# Altium schematic sheet CD40106_施密特触发电路.SchDoc
size A4
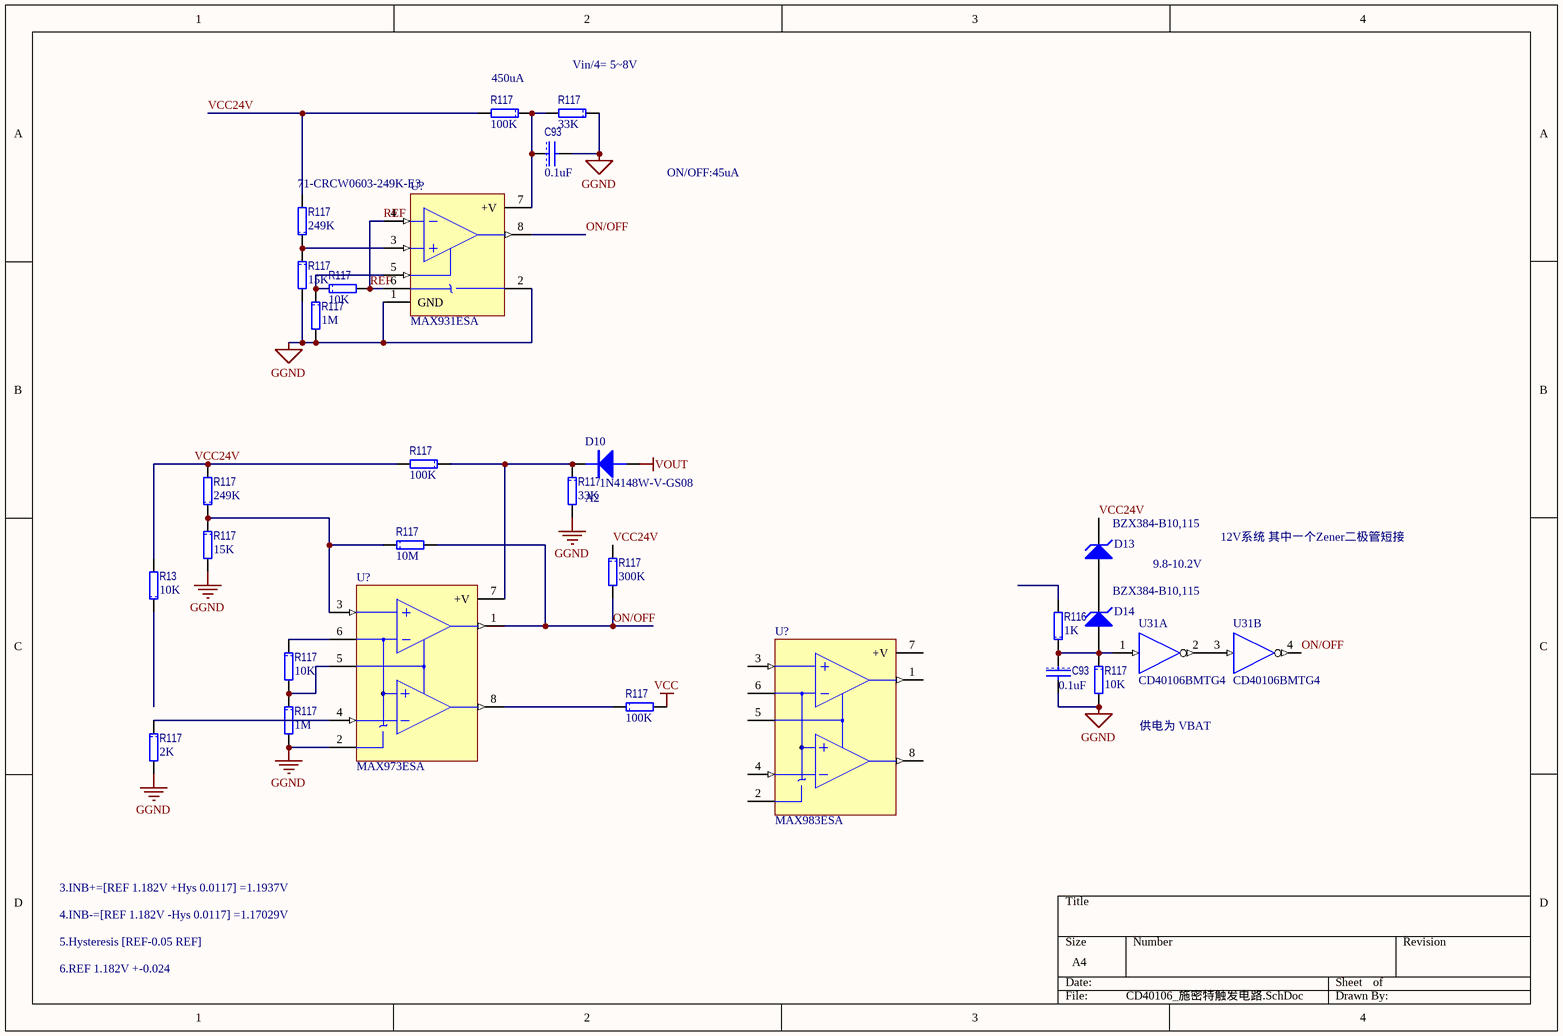
[diagram p0: CD40106_施密特触发电路.SchDoc]

## Parts
(Parts that share a designator on the sheet are numbered #1, #2 ... from top to bottom, then left to right.)
C93#1  value 0.1uF  [1608[0603]C]  (hidden comment: C1608X7R1H104K)
C93#2  value 0.1uF  [1608[0603]C]  (hidden comment: C1608X7R1H104K)
D10  1N4148W-V-GS08  value A2  [SOD323]
D13  BZX384-B10,115  [SOD323]
D14  BZX384-B10,115  [SOD323]
R13  value 10K  [1608[0603]R]  (hidden comment: CRCW0603100KFKEA)
R116  value 1K  [1608[0603]R]  (hidden comment: CRCW06031K00FKEA)
R117#1  value 100K  [1608[0603]R]  (hidden comment: CRCW0603100KFKEA)
R117#2  value 33K  [1608[0603]R]  (hidden comment: CRCW060333K0FKEA)
R117#3  value 249K  Supplier Part Number 1: 71-CRCW0603-249K-E3  [1608[0603]R]  (hidden comment: CRCW0603249KFKEA)
R117#4  value 15K  [1608[0603]R]  (hidden comment: CRCW060315K0FKEA)
R117#5  value 10K  [1608[0603]R]  (hidden comment: CRCW060310K0FKEA)
R117#6  value 1M  [1608[0603]R]  (hidden comment: CRCW060310K0FKEA)
R117#7  value 100K  [1608[0603]R]  (hidden comment: CRCW0603300K0FKEA)
R117#8  value 33K  [1608[0603]R]  (hidden comment: CRCW0603100K0FKEA)
R117#9  value 249K  [1608[0603]R]  (hidden comment: CRCW0603249KFKEA)
R117#10  value 15K  [1608[0603]R]  (hidden comment: CRCW060315K0FKEA)
R117#11  value 10M  [1608[0603]R]  (hidden comment: CRCW060310M0FKEA)
R117#12  value 300K  [1608[0603]R]  (hidden comment: CRCW0603300K0FKEA)
R117#13  value 10K  [1608[0603]R]  (hidden comment: CRCW060310K0FKEA)
R117#14  value 10K  [1608[0603]R]  (hidden comment: CRCW060310K0FKEA)
R117#15  value 100K  [1608[0603]R]  (hidden comment: CRCW0603300K0FKEA)
R117#16  value 1M  [1608[0603]R]  (hidden comment: CRCW060310K0FKEA)
R117#17  value 2K  [1608[0603]R]  (hidden comment: CRCW060310K0FKEA)
U31  CD40106BMTG4  [SOIC14_N]  (parts A,B of 6)
U?#1  MAX931ESA  [NSO8_N]
U?#2  MAX973ESA  [NSO8_N]
U?#3  MAX983ESA  [NSO8_N]

## Nets
GGND: C93#1.2 C93#2.2 R117#2.1 R117#4.2 R117#6.2 R117#8.2 R117#10.2 R117#14.2 R117#16.2 R117#17.2 U?#1.1(GND) U?#1.2(-V) U?#2.2(V-)
GND: U31.7(GGND)
VCC: R117#15.2 U31.14(VBAT)
VOUT: D10.1(A)
ON/OFF: R117#11.2 R117#12.2 U31.4(H) U?#1.8(OUT) U?#2.1(OUTA)
REF: R117#5.2 U?#1.4(IN-) U?#1.6(REF)
VCC24V: D13.2(K) R13.2 R117#1.2 R117#3.2 R117#7.2 R117#9.2 R117#12.1
NetC93#1_1: C93#1.1 R117#1.1 R117#2.2 U?#1.7(+V)
NetC93#2_1: C93#2.1 D14.1(A) R116.1 R117#14.1 U31.1(A)
NetD10_2: D10.2(K) R117#7.1 R117#8.1 U?#2.7(+V)
NetD13_1: D13.1(A) D14.2(K)
NetR117#3_1: R117#3.1 R117#4.1 U?#1.3(IN+)
NetR117#5_1: R117#5.1 R117#6.1 U?#1.5(HYST)
NetR117#9_1: R117#9.1 R117#10.1 R117#11.1 U?#2.3(INA+)
NetR117#13_1: R117#13.1 U?#2.6(REF)
NetR117#13_2: R117#13.2 R117#16.1 U?#2.5(HYST)
NetR117#15_1: R117#15.1 U?#2.8(OUTB)
NetR117#17_1: R117#17.1 U?#2.4(INB-)
NetU31_2: U31.2(G) U31.3(B)

Not connected (* = marked no-connect by the designer): R13 1; R116 2; U?#3 1(OUTA) 2(V-) 3(INA+) 4(INB-) 5(HYST) 6(REF) 7(+V) 8(OUTB)

## Notes on the sheet
- (near R117#1) 450uA
- (near R117#2) Vin/4= 5~8V
- ON/OFF:45uA
- 9.8-10.2V
- 12V系统 其中一个Zener二极管短接
- 供电为 VBAT
- 4.INB-=[REF 1.182V -Hys 0.0117] =1.17029V
- 3.INB+=[REF 1.182V +Hys 0.0117] =1.1937V
- 6.REF 1.182V +-0.024
- 5.Hysteresis [REF-0.05 REF]

## Library data of the parts
C93#1 C93#2 = CAP: 多层陶瓷电容器MLCC - SMD/SMT 0603 0.1uF 50volts X7R 10%; Manufacturer: TDK; 尺寸: 0.8 mm W x 1.6 mm L x 0.8 mm H; 工作温度范围: - 55 C to + 125 C; 封装 / 箱体: 0603 (1608 metric); 封装: Reel; 产品: General Type MLCCs; 系列: C; 电压额定值: 50 V; 电容-nF: 100 nF; 电容-pF: 100000 pF; 外壳代码 - in: 0603; 外壳代码 - mm: 1608; 产品种类: Low & Medium Capacitance SMD Ceramic Chip Capacitors; 标准包装数量: 4000; Supplier 1: Mouser; Supplier Part Number 1: 810-C1608X7R1H104K; Manufacturer Part Number: C1608X7R1H104K; RoHS: RoHS Compliant; Description 1: 多层陶瓷电容器MLCC - SMD/SMT 0603 0.1uF 50volts X7R 10%; Category: 多层陶瓷电容器MLCC - SMD/SMT; Stock 1: 224604; Pricing 1: 1=0.160, 50=0.070, 100=0.036, 500=0.019, 1000=0.013, 4000=0.010, 8000=0.009, 12000=0.008, 20000=0.007 (USD); 电容: 0.1 uF; 端接类型: SMD/SMT; 容差: 10 %; 制造商: TDK; 温度系数/代码: X7R; RoHS - 贸泽: Y; Minimum Order Quantity: 1; Reeling: True; ComponentLink1URL: http://www.tdk.com/pdf/general_B11.pdf; ComponentLink1Description: http://www.tdk.com/pdf/general_B11.pdf
D10 = 1N4148W: 二极管 - 通用，功率，开关 100V Io/150mA; Manufacturer: Vishay Semiconductors; 配置: Single; 工作温度范围: - 65 C to + 150 C; 封装 / 箱体: SOD-123; 封装: Reel; 产品: Switching Diodes; 正向连续电流: 0.15 A; 最大浪涌电流: 0.5 A; 安装风格: SMD/SMT; 恢复时间: 4 ns; 正向电压下降: 1.2 V; 制造商: Vishay; 最大二极管电容: 4 pF; 最大工作温度: + 150 C; 最大功率耗散: 350 mW; 最大反向漏泄电流: 5 uA; 最小工作温度: - 65 C; 标准包装数量: 15000; Supplier 1: Mouser; Supplier Part Number 1: 625-1N4148W-V; Manufacturer Part Number: 1N4148W-V-GS08; RoHS: RoHS Compliant; Category: 二极管 - 通用，功率，开关; Stock 1: 404148; Pricing 1: 1=0.090, 10=0.083, 50=0.072, 100=0.068, 500=0.032, 1000=0.026, 3000=0.021, 9000=0.016, 10000=0.016, 18000=0.014 (USD); 峰值反向电压: 100 V; 产品种类: Switching Diodes; RoHS - 贸泽: Y; Minimum Order Quantity: 1; Reeling: True; ComponentLink1URL: http://www.mouser.com/ds/2/427/1n4148w--240387.pdf; ComponentLink1Description: http://www.mouser.com/ds/2/427/1n4148w--240387.pdf; Description 1: 二极管 - 通用，功率，开关 100V Io/150mA
D13 D14 = D Zener: 稳压二极管 DIODE ZENER 2 PCT; Manufacturer: Vishay Semiconductors; Manufacturer Part Number: BZX384B10-E3-08; Configuration: Single; Power Dissipation: 200 mW; Maximum Reverse Leakage Current: 0.2 uA; Maximum Zener Impedance: 8 Ohms; Voltage Tolerance: 2 %; Zener Voltage: 10 V; Product Status: New at Mouser; Supplier 1: Mouser; Supplier Part Number 1: 78-BZX384B10-E3-08; RoHS: RoHS Compliant; Category: Zener Diodes; Stock 1: 14963; Pricing 1: 1=0.135, 10=0.059, 50=0.058, 100=0.057, 500=0.049, 1000=0.045, 3000=0.043, 9000=0.042, 18000=0.041 (AUD); Package / Case: SOD-323; Packaging: Reel; Product: Zener Diode; Mounting Style: SMD/SMT; Maximum Operating Temperature: + 150 C; Minimum Operating Temperature: - 55 C; Product Category: Schottky Diodes; RoHS - Mouser: Y; Minimum Order Quantity: 1; Reeling: True; ComponentLink1URL: http://www.mouser.com/ds/2/427/bzx384-260632.pdf; ComponentLink1Description: http://www.mouser.com/ds/2/427/bzx384-260632.pdf
R13 = RES: 厚膜电阻器 - SMD 1/10watt 100Kohms 1%; Manufacturer: Vishay / Dale; 尺寸: 0.85 mm W x 1.55 mm L x 0.45 mm H; 工作温度范围: - 55 C to + 155 C; 封装 / 箱体: 0603 (1608 metric); 封装: Reel; 功率额定值: 100 mW; 产品: Thick Film Resistors SMD; 系列: CRCW; 温度系数: 100 PPM / K; 端接类型: SMD/SMT; 电压额定值: 75 V; 制造商: Vishay; 产品种类: 0603 Thick Film Chip Resistors; 标准包装数量: 5000; 外壳代码 - in: 0603; 外壳代码 - mm: 1608; Supplier 1: Mouser; Supplier Part Number 1: 71-CRCW0603-100K-E3; Manufacturer Part Number: CRCW0603100KFKEA; RoHS: RoHS Compliant By Exemption; Category: 厚膜电阻器 - SMD; Stock 1: 175756; Pricing 1: 1=0.080, 10=0.013, 100=0.010, 1000=0.008, 5000=0.005, 25000=0.004, 50000=0.003 (USD); 电阻: 100 kOhms; 容差: 1 %; RoHS - 贸泽: E; Minimum Order Quantity: 1; Reeling: True; ComponentLink1URL: http://www.mouser.com/ds/2/427/dcrcwe3-109170.pdf; ComponentLink1Description: http://www.mouser.com/ds/2/427/dcrcwe3-109170.pdf; Description 1: 厚膜电阻器 - SMD 1/10watt 100Kohms 1%
R116 = RES: 厚膜电阻器 - SMD 1/10watt 1.0Kohms 1%; Manufacturer: Vishay / Dale; 尺寸: 0.85 mm W x 1.55 mm L x 0.45 mm H; 工作温度范围: - 55 C to + 155 C; 封装 / 箱体: 0603 (1608 metric); 封装: Reel; 功率额定值: 100 mW; 产品: Thick Film Resistors SMD; 电阻: 1 kOhms; 系列: CRCW; 温度系数: 100 PPM / K; 端接类型: SMD/SMT; 电压额定值: 75 V; 制造商: Vishay; 产品种类: 0603 Thick Film Chip Resistors; 标准包装数量: 5000; 外壳代码 - in: 0603; 外壳代码 - mm: 1608; Supplier 1: Mouser; Supplier Part Number 1: 71-CRCW0603-1.0K-E3; Manufacturer Part Number: CRCW06031K00FKEA; RoHS: RoHS Compliant By Exemption; Category: 厚膜电阻器 - SMD; Stock 1: 276938; Pricing 1: 1=0.080, 10=0.013, 100=0.010, 1000=0.008, 5000=0.005, 25000=0.004, 50000=0.003 (USD); 容差: 1 %; RoHS - 贸泽: E; Minimum Order Quantity: 1; Reeling: True; ComponentLink1URL: http://www.mouser.com/ds/2/427/dcrcwe3-109170.pdf; ComponentLink1Description: http://www.mouser.com/ds/2/427/dcrcwe3-109170.pdf; Description 1: 厚膜电阻器 - SMD 1/10watt 1.0Kohms 1%
R117#1 R117#7 R117#15 = RES: 厚膜电阻器 - SMD 1/10watt 200Kohms 1%
R117#2 = RES: 厚膜电阻器 - SMD 1/10watt 33Kohms 1%
R117#3 = RES: 厚膜电阻器 - SMD 1/10watt 249Kohms 1%; Manufacturer: Vishay / Dale; Description: Thick Film Resistors - SMD 1/10watt 249Kohms 1%; Power Rating: 100 mW; Temperature Coefficient: 100 PPM / K; Voltage Rating: 75 V; Case Height: 0.45 mm; Case Length: 1.55 mm; Case Width: 0.85 mm; Supplier 1: Mouser; Manufacturer Part Number: CRCW0603249KFKEA; RoHS: RoHS Compliant By Exemption; Category: Thick Film Resistors - SMD; Stock 1: 63391; Pricing 1: 1=0.108, 10=0.018, 100=0.014, 1000=0.011, 5000=0.007, 25000=0.005, 50000=0.004 (AUD); Operating Temperature Range: - 55 C to + 155 C; Package / Case: 0603 (1608 metric); Packaging: Reel; Product: Thick Film Resistors SMD; Resistance: 249 kOhms; Series: CRCW; Tolerance: 1 %; Case Code - in: 0603; Case Code - mm: 1608; Product Category: 0603 Thick Film Chip Resistors; Standard Pack Qty: 5000; RoHS - Mouser: E; Minimum Order Quantity: 1; Reeling: True; ComponentLink1URL: http://www.vishay.com/doc?20035; ComponentLink1Description: http://www.vishay.com/doc?20035
R117#4 = RES: 厚膜电阻器 - SMD 1/10watt 15Kohms 1%; Manufacturer: Vishay / Dale; Description: Thick Film Resistors - SMD 1/10watt 15Kohms 1%; Power Rating: 100 mW; Temperature Coefficient: 100 PPM / K; Voltage Rating: 75 V; Case Height: 0.45 mm; Case Length: 1.55 mm; Case Width: 0.85 mm; Supplier 1: Mouser; Supplier Part Number 1: 71-CRCW0603-15K-E3; Manufacturer Part Number: CRCW060315K0FKEA; RoHS: RoHS Compliant By Exemption; Category: Thick Film Resistors - SMD; Stock 1: 103280; Pricing 1: 1=0.108, 10=0.018, 100=0.014, 1000=0.011, 5000=0.007, 25000=0.005, 50000=0.004 (AUD); Operating Temperature Range: - 55 C to + 155 C; Package / Case: 0603 (1608 metric); Packaging: Reel; Product: Thick Film Resistors SMD; Resistance: 15 kOhms; Series: CRCW; Tolerance: 1 %; Case Code - in: 0603; Case Code - mm: 1608; Product Category: 0603 Thick Film Chip Resistors; Standard Pack Qty: 5000; RoHS - Mouser: E; Minimum Order Quantity: 1; Reeling: True; ComponentLink1URL: http://www.vishay.com/doc?20035; ComponentLink1Description: http://www.vishay.com/doc?20035
R117#5 R117#6 R117#13 R117#14 R117#16 R117#17 = RES: 厚膜电阻器 - SMD 1/10watt 10Kohms 1%; Manufacturer: Vishay / Dale; 尺寸: 0.85 mm W x 1.55 mm L x 0.45 mm H; 工作温度范围: - 55 C to + 155 C; 封装 / 箱体: 0603 (1608 metric); 封装: Reel; 功率额定值: 100 mW; 产品: Thick Film Resistors SMD; 系列: CRCW; 温度系数: 100 PPM / K; 端接类型: SMD/SMT; 电压额定值: 75 V; 制造商: Vishay; 产品种类: 0603 Thick Film Chip Resistors; 标准包装数量: 5000; 外壳代码 - in: 0603; 外壳代码 - mm: 1608; Supplier 1: Mouser; Supplier Part Number 1: 71-CRCW0603-10K-E3; Manufacturer Part Number: CRCW060310K0FKEA; RoHS: RoHS Compliant By Exemption; Category: 厚膜电阻器 - SMD; Stock 1: 0; Pricing 1: 1=0.080, 10=0.013, 100=0.010, 1000=0.008, 5000=0.005, 25000=0.004, 50000=0.003 (USD); 电阻: 10 kOhms; 容差: 1 %; RoHS - 贸泽: E; Minimum Order Quantity: 1; Reeling: True; ComponentLink1URL: http://www.mouser.com/ds/2/427/dcrcwe3-109170.pdf; ComponentLink1Description: http://www.mouser.com/ds/2/427/dcrcwe3-109170.pdf; Description 1: 厚膜电阻器 - SMD 1/10watt 10Kohms 1%
R117#8 R117#11 = RES: 厚膜电阻器 - SMD 1/10watt 10Mohms 1%
R117#9 = RES: 厚膜电阻器 - SMD 1/10watt 249Kohms 1%
R117#10 = RES: 厚膜电阻器 - SMD 1/10watt 15Kohms 1%
R117#12 = RES: 厚膜电阻器 - SMD 1/10watt 300Kohms 1%
U31 = HCF40106BM1: Hex Schmitt Trigger; Manufacturer: Texas Instruments; Number of Circuits: 6; Logic Family: CD4000; Logic Type: CMOS; High Level Output Current: - 4.2 mA; Low Level Output Current: 4.2 mA; Propagation Delay Time: 280 ns, 140 ns, 120 ns; Supply Voltage - Max: 18 V; Supply Voltage - Min: 3 V; Supplier 1: Mouser; Supplier Part Number 1: 595-CD40106BMTG4; Manufacturer Part Number: CD40106BMTG4; RoHS: RoHS Compliant; Category: Inverters; Stock 1: 1137; Pricing 1: 1=1.30, 10=1.04, 100=0.771, 250=0.771, 1000=0.518, 5000=0.437, 10000=0.421, 25000=0.405 (AUD); Package / Case: SOIC-14; Packaging: Reel; Series: CD40106B; Mounting Style: SMD/SMT; Maximum Operating Temperature: + 125 C; Product Category: Logic - Buffers, Drivers, and Transceivers; Standard Pack Qty: 250; RoHS - Mouser: Y; Minimum Order Quantity: 1; Reeling: True; ComponentLink1URL: http://www.mouser.com/ds/2/405/schs097d-127287.pdf; ComponentLink1Description: http://www.mouser.com/ds/2/405/schs097d-127287.pdf
U?#1 = MAX931ESA: Ultra Low-Power, Low-Cost Comparator with 2% Reference; Published: 16-Jan-2001; LatestRevisionDate: 13-Apr-2006; LatestRevisionNote: IPC-7351 Footprint Added.; DatasheetVersion: Feb-1997; PackageReference: NSO8; Publisher: Altium Limited; PackageDescription: 8-Pin Small Outline Integrated Circuit 1.27 mm Pitch; Code_JEDEC: MS-012-AA; Code_IPC: SOIC127P600-8; ComponentLink1Description: Manufacturer Link; ComponentLink1URL: http://www.maxim-ic.com/; ComponentLink2Description: Datasheet; ComponentLink2URL: http://pdfserv.maxim-ic.com/en/ds/MAX931-MAX934.pdf
U?#2 = MAX973ESA: Ultra-Low-Power, Open Drain, Single/Dual-Supply Comparator; Published: 16-Jan-2001; LatestRevisionDate: 13-Apr-2006; LatestRevisionNote: IPC-7351 Footprint Added.; DatasheetVersion: Nov-1995; PackageReference: NSO8; Publisher: Altium Limited; PackageDescription: 8-Pin Small Outline Integrated Circuit 1.27 mm Pitch; Code_JEDEC: MS-012-AA; Code_IPC: SOIC127P600-8; ComponentLink1Description: Manufacturer Link; ComponentLink1URL: http://www.maxim-ic.com/; ComponentLink2Description: Datasheet; ComponentLink2URL: http://pdfserv.maxim-ic.com/en/ds/MAX971-MAX984.pdf
U?#3 = MAX983ESA: Ultra-Low-Power, Open Drain, Single/Dual-Supply Comparator; Published: 16-Jan-2001; LatestRevisionDate: 13-Apr-2006; LatestRevisionNote: IPC-7351 Footprint Added.; DatasheetVersion: Nov-1995; PackageReference: NSO8; Publisher: Altium Limited; PackageDescription: 8-Pin Small Outline Integrated Circuit 1.27 mm Pitch; Code_JEDEC: MS-012-AA; Code_IPC: SOIC127P600-8; ComponentLink1Description: Manufacturer Link; ComponentLink1URL: http://www.maxim-ic.com/; ComponentLink2Description: Datasheet; ComponentLink2URL: http://pdfserv.maxim-ic.com/en/ds/MAX971-MAX984.pdf